# EAGLE design schematic (EAGLE 9.6.2)
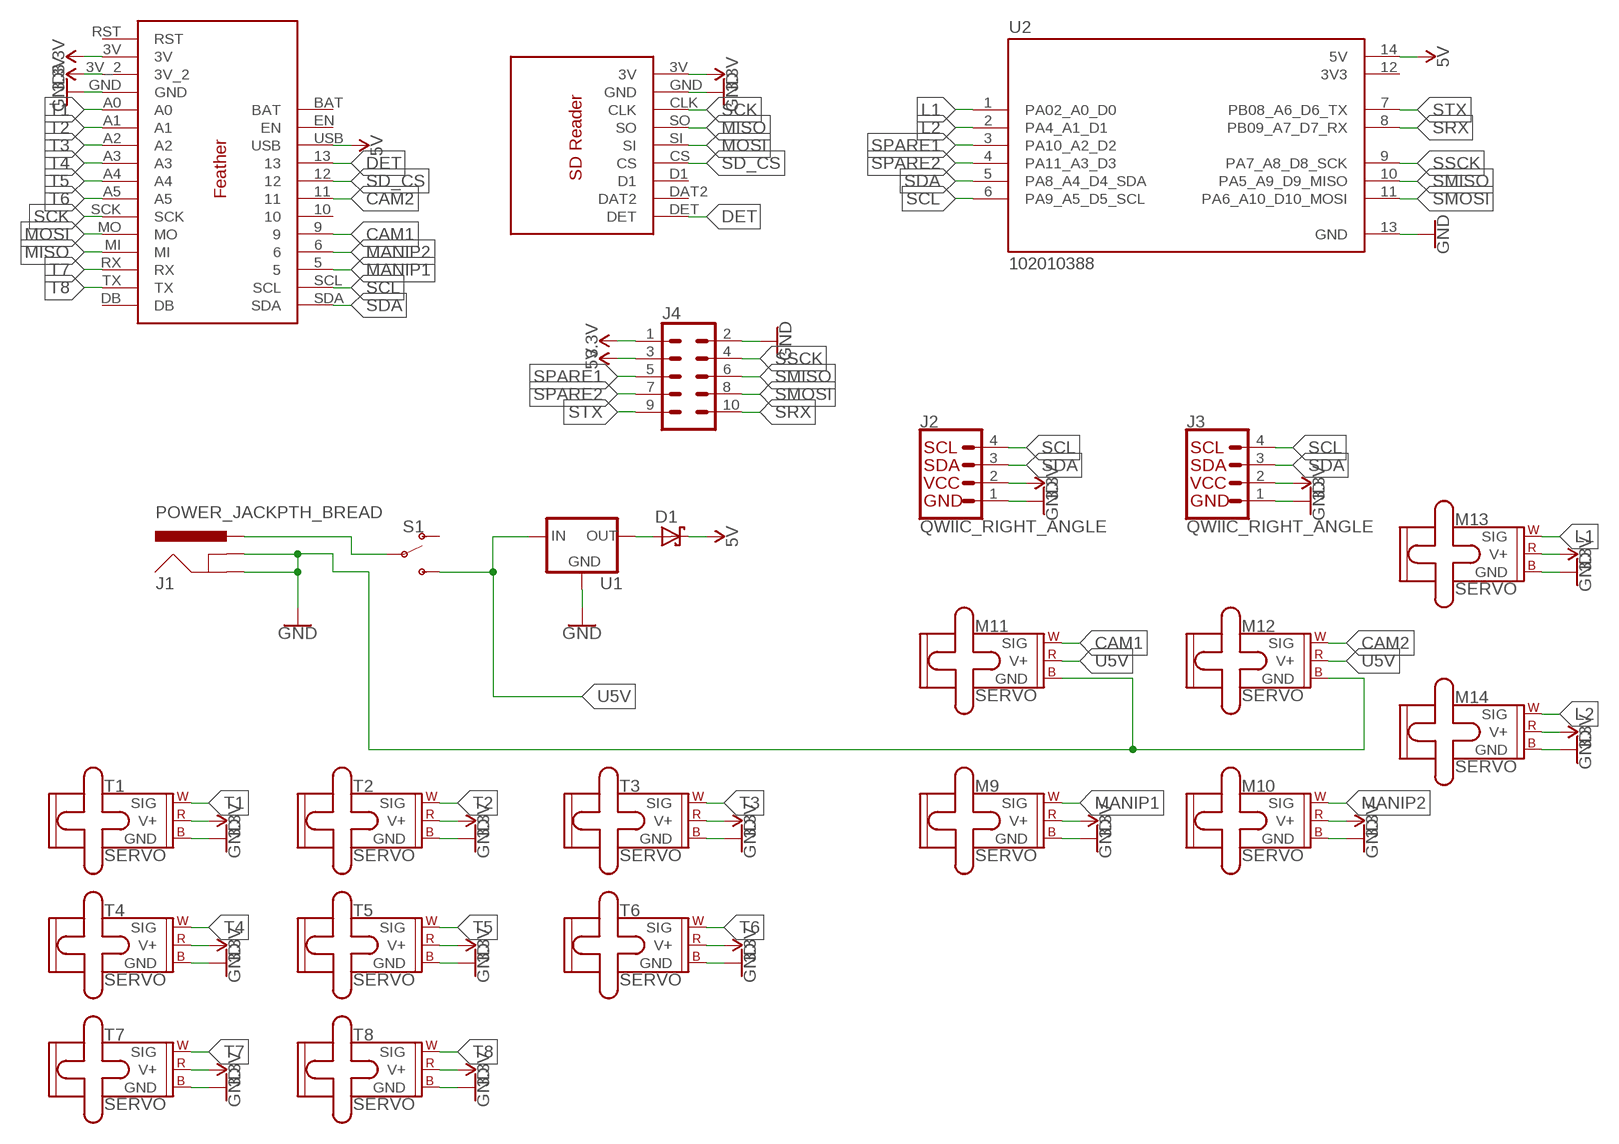
[diagram p0: schematic, sheet 1]

## Parts
D1  SCHOTTKY-DIODEDO41  [DO41-10]
J1  POWER_JACKPTH_BREAD  [POWER_JACK_PTH_BREAD]
J2  QWIIC_RIGHT_ANGLE  QWIIC_CONNECTORJS-1MM  [JST04_1MM_RA]
J3  QWIIC_RIGHT_ANGLE  QWIIC_CONNECTORJS-1MM  [JST04_1MM_RA]
J4  CONN_05X2PTH  [2X5]
M9  SERVO  [1X03]
M10  SERVO  [1X03]
M11  SERVO  [1X03]
M12  SERVO  [1X03]
M13  SERVO  [1X03]
M14  SERVO  [1X03]
S1  SWITCH-SPDT-PTH-11.6X4.0MM  [SWITCH_SPDT_PTH_11.6X4.0MM]
T1  SERVO  [1X03]
T2  SERVO  [1X03]
T3  SERVO  [1X03]
T4  SERVO  [1X03]
T5  SERVO  [1X03]
T6  SERVO  [1X03]
T7  SERVO  [1X03]
T8  SERVO  [1X03]
U1  V_REG_78XXSIDE  [78XXL]
U2  102010388  [MODULE_102010388]
U$1  FEATHER  [FEATHER]
U$3  SD  [SD]

## Nets
3.3V: J2.2 J3.2 J4.1 M9.2(V+) M10.2(V+) M13.2(V+) M14.2(V+) T1.2(V+) T2.2(V+) T3.2(V+) T4.2(V+) T5.2(V+) T6.2(V+) T7.2(V+) T8.2(V+) U$1.3V U$1.3V_2 U$3.3V
5V: D1.C J4.3 U2.14(5V) U$1.USB
CAM1: M11.1(SIG) U$1.9
CAM2: M12.1(SIG) U$1.11
DET: U$1.13 U$3.DET
GND: J1.GND J1.GNDBREAK J2.1 J3.1 J4.2 M9.3(GND) M10.3(GND) M11.3(GND) M12.3(GND) M13.3(GND) M14.3(GND) T1.3(GND) T2.3(GND) T3.3(GND) T4.3(GND) T5.3(GND) T6.3(GND) T7.3(GND) T8.3(GND) U1.GND U2.13(GND) U$1.GND U$3.GND
L1: M13.1(SIG) U2.1(PA02_A0_D0)
L2: M14.1(SIG) U2.2(PA4_A1_D1)
MANIP1: M9.1(SIG) U$1.5
MANIP2: M10.1(SIG) U$1.6
MISO: U$1.MI U$3.SO
MOSI: U$1.MO U$3.SI
N$2: J1.PWR S1.2(P)
N$25: D1.A U1.OUT
SCK: U$1.SCK U$3.CLK
SCL: J2.4 J3.4 U2.6(PA9_A5_D5_SCL) U$1.SCL
SD_CS: U$1.12 U$3.CS
SDA: J2.3 J3.3 U2.5(PA8_A4_D4_SDA) U$1.SDA
SMISO: J4.6 U2.10(PA5_A9_D9_MISO)
SMOSI: J4.8 U2.11(PA6_A10_D10_MOSI)
SPARE1: J4.5 U2.3(PA10_A2_D2)
SPARE2: J4.7 U2.4(PA11_A3_D3)
SRX: J4.10 U2.8(PB09_A7_D7_RX)
SSCK: J4.4 U2.9(PA7_A8_D8_SCK)
STX: J4.9 U2.7(PB08_A6_D6_TX)
T1: T1.1(SIG) U$1.A0
T2: T2.1(SIG) U$1.A1
T3: T3.1(SIG) U$1.A2
T4: T4.1(SIG) U$1.A3
T5: T5.1(SIG) U$1.A4
T6: T6.1(SIG) U$1.A5
T7: T7.1(SIG) U$1.RX
T8: T8.1(SIG) U$1.TX
U5V: M11.2(V+) M12.2(V+) S1.3(S) U1.IN
Unconnected: S1.1(O) U$1.10 U$1.BAT U$1.DB U$1.EN U$1.RST U$3.D1 U$3.DAT2

## Power pins joined to a net without a drawn wire
3V3: U2.12(3V3)

## Library data of the parts
D1 = adafruit:SCHOTTKY-DIODE: Schottky Diode
J1 = SparkFun-Connectors:POWER_JACK: Power Jack Connector This is the standard 5.5mm barrel jack for power. The PTH is the most common, proven, reliable, footprint. The Slot footprint only works if the mill layer is transmitted to the PCB fab house so be warned. Here are the connectors we sell at SparkFun: DC Barrel Power Jack/Connector <https://www.sparkfun.com/products/119> (PRT-00119) DC Barrel Power Jack/Connector (SMD) <https://www.sparkfun.com/products/12748> (PRT-12748) DC Barrel Jack Adapter - Breadboard Compatible <https://www.sparkfun.com/products/10811> (PRT-10811) It is used on this SparkFun product (and many, many others): SparkFun RedBoard - Programmed with Arduino <https://www.sparkfun.com/products/12757> (DEV-12757) Also, if you need a mating power supply or connector, please check these out: Wall Adapter Power Supply - 9VDC 650mA <https://www.sparkfun.com/products/298> (TOL-00298) DC Barrel Jack Adapter - Male <https://www.sparkfun.com/products/10287> (PRT-10287); PROD_ID: COMP-13253
J2 J3 = SparkFun-Connectors:QWIIC_CONNECTOR: SparkFun I2C Standard Qwiic Connector An SMD 1mm pitch JST connector makes it easy and quick (get it? Qwiic?) to connect I2C devices to each other. The Qwiic system <http://www.sparkfun.com/qwiic> enables fast and solderless connection between popular platforms and various sensors and actuators. We carry 200mm <https://www.sparkfun.com/products/14204>, 100mm <https://www.sparkfun.com/products/14205>, 50mm <https://www.sparkfun.com/products/14206>, and breadboard friendly <https://www.sparkfun.com/products/14207> Qwiic cables. We also offer 10 pcs strips <https://www.sparkfun.com/products/14323> the SMD connectors.; PROD_ID: CONN-13694
J4 = SparkFun-Connectors:CONN_05X2: Multi connection point. Often used as Generic Header-pin footprint for 0.1 inch spaced/style header connections For AVR SPI programming port, see special device with nice symbol: "AVR_SPI_PROG_5x2.dev" You can populate with any combo of single row headers, but if you'd like an exact match, check these: 2x5 AVR ICSP Male Header <https://www.sparkfun.com/products/778> (PRT-00778) 2x5 Pin Shrouded Header <https://www.sparkfun.com/products/8506> (PRT-08506) On any of the 0.1 inch spaced packages, you can populate with these: Break Away Headers - Straight <https://www.sparkfun.com/products/116> (PRT-00116) Break Away Male Headers - Right Angle <https://www.sparkfun.com/products/553> (PRT-00553) Female Headers <https://www.sparkfun.com/products/115> (PRT-00115) Break Away Headers - Machine Pin <https://www.sparkfun.com/products/117> (PRT-00117) Break Away Female Headers - Swiss Machine Pin <https://www.sparkfun.com/products/743> (PRT-00743) Special note: the shrouded connector mates well with our 5x2 ribbon cables: 2x5 Pin IDC Ribbon Cable <https://www.sparkfun.com/products/8535> (PRT-08535); PROD_ID: CONN-08499; SF_ID: PRT-0778
M9-M14 T1-T8 = SparkFun-Electromechanical:SERVO: Servo Motor 3-pin connector for a standard servo motor (voltage supply, ground, and control signal.) SparkFun Products Servo - Generic (Sub-Micro Size) <https://www.sparkfun.com/products/9065> (ROB-09065) Servo - Generic High Torque Continuous Rotation (Standard Size) <https://www.sparkfun.com/products/9347> (ROB-09347) Servo - Generic High Torque (Standard Size) <https://www.sparkfun.com/products/11965> (ROB-11965)
S1 = SparkFun-Switches:SWITCH-SPDT: Single Pole, Double Throw (SPDT) Switch Single-pole, double-throw (SPDT) switch. Variant Overview SMD-AYZ0202 Surface Mount DPDT Switch <https://www.sparkfun.com/products/597> (COM-00597) Used on e.g. LilyPad Arduino USB - ATmega32U4 Board <https://www.sparkfun.com/products/12049> PTH-11.6X4.0MM SPDT Mini Power Switch <https://www.sparkfun.com/products/102> (COM-00102) Used on e.g. SparkFun Simon Says - Through-Hole Soldering Kit <https://www.sparkfun.com/products/10547> (KIT-10547) PTH-11.6X4.0MM-KIT KIT version of SPDT Mini Power Switch - Simplifies soldering by removing tStop of switch pins - only one side can be soldered. PTH-11.6X4.0MM-LOCK LOCK version of SPDT Mini Power Switch - Offset pins hold switch in place for easier soldering. SMD-RIGHT-ANGLE Surface Mount Right Angle Switch <https://www.sparkfun.com/products/10860> (COM-10860) Used on e.g. SparkFun ESP8266 Thing <https://www.sparkfun.com/products/13231>; PROD_ID: SWCH-08261; SF_SKU: COM-00102
U1 = SparkFun-IC-Power:V_REG_78XX: Voltage Regulator Standard 78xx regulator. IGO (Input Ground Output). Spark Fun Electronics SKU : COM-00107
U2 = 102010388:102010388: Check availability <https://pricing.snapeda.com/parts/102010388/Seeed%20Technology%20Co.%2C%20Ltd/view-part?ref=eda>; AVAILABILITY: In Stock; DESCRIPTION: Seeeduino XIAO Development Board, Pre-Soldered [Seeed Studio] 102010388 Seeeduino XIAO Development Board, Pre-Soldered; MF: Seeed Technology Co., Ltd; MP: 102010388; PACKAGE: None; PRICE: None; PURCHASE-URL: https://pricing.snapeda.com/search/part/102010388/?ref=eda
U$1 = Robotics-Customs:FEATHER
U$3 = Robotics-Customs:SD

## Board
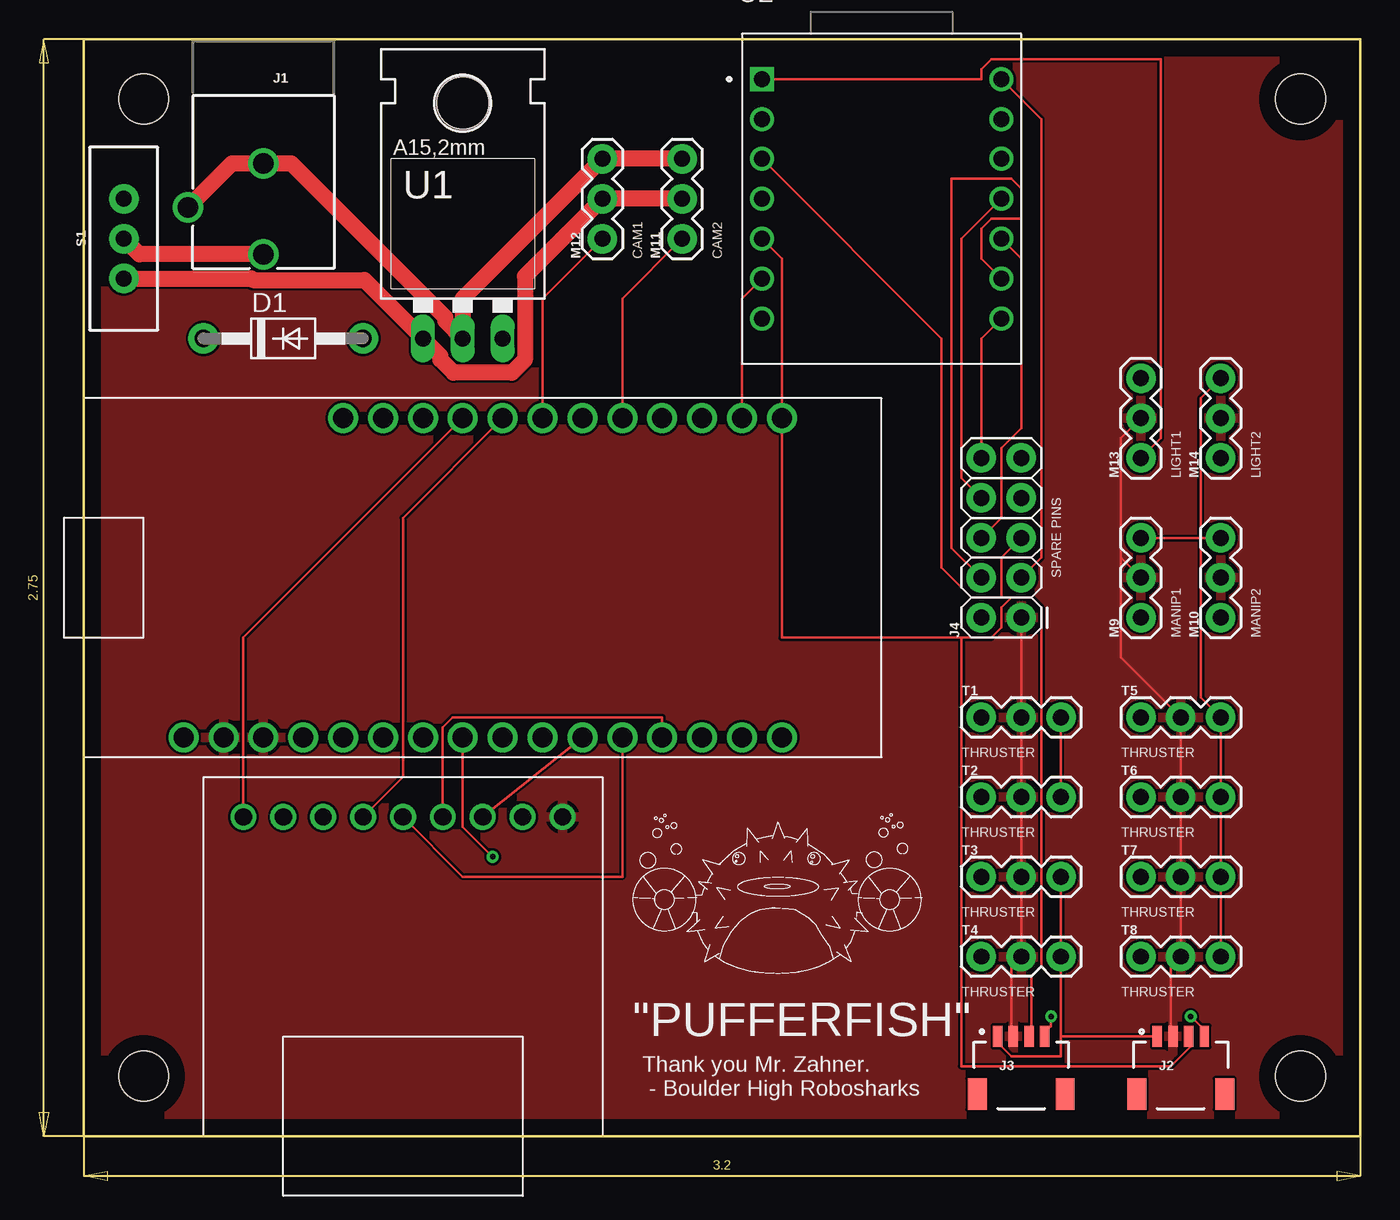
[diagram p1: board, top side]
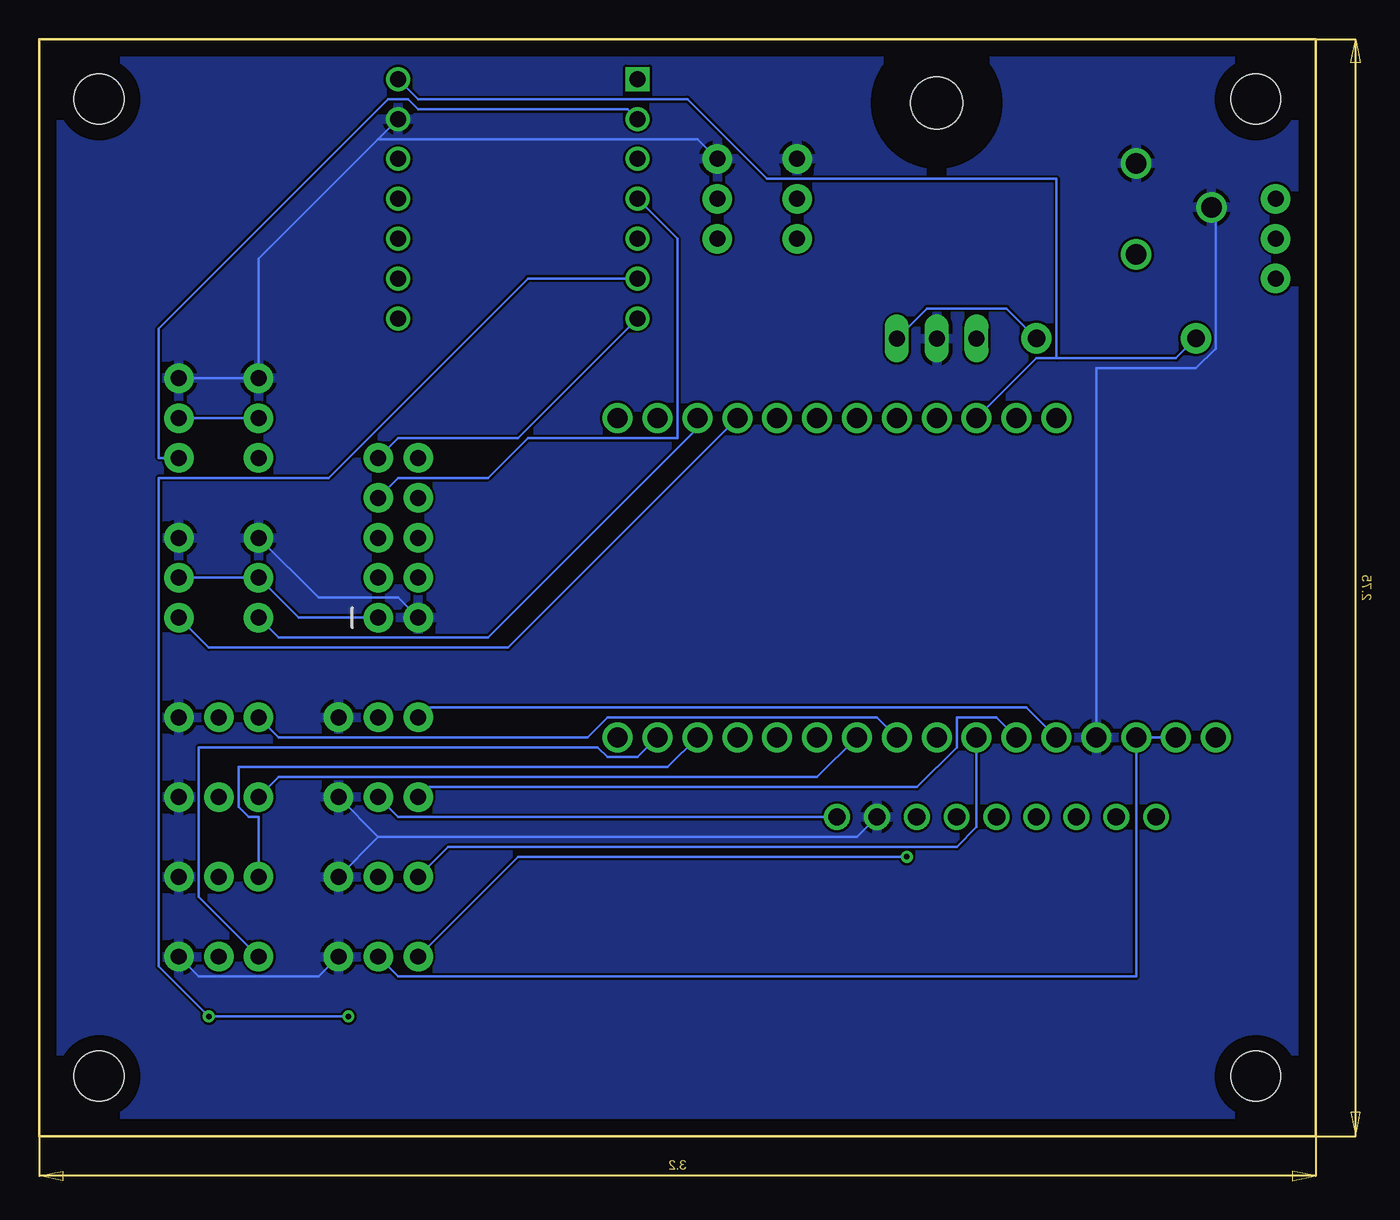
[diagram p2: board, bottom side, seen from below]

Size 81.28 x 69.85 mm. Coordinates in mm from the lower left corner, seen from the top.
Outline: 0,0 81.28,0 81.28,69.85 0,69.85 0,0
Copper layers (1*16): Top 0.035mm / dielectric 1.5mm / Bottom 0.035mm
Design rules "default": minimum track width 6mil, minimum drill 0.35mm, track to track 6mil, track to pad 6mil, pad to pad 6mil, via to via 6mil, smd to smd 6mil, copper to edge 40mil, drill to drill 6mil, minimum pad ring 10mil, minimum via ring 8mil, stop-mask expansion 4mil, vias tented up to drill 0mil, thermal gap 10mil
Holes 3.17 mm at 3.81,66.04 77.47,66.04 77.47,3.81 3.81,3.81

### Footprints (pad centres in the part's own frame; a part is rotated, then mirrored left to right if it is on the bottom)
DO41-10 = drill 1.118 pad 1.93: A 5.08,0; C -5.08,0
POWER_JACK_PTH_BREAD = drill 1.3: GND 0,7.9; GNDBREAK 4.8,10.7; PWR 0,13.7
JST04_1MM_RA = smd 0.6 x 1.35: 1 -1.5,0; 2 -0.5,0; 3 0.5,0; 4 1.5,0 | smd 1.2 x 2: NC1 2.8,-3.675; NC2 -2.8,-3.675
2X5 = drill 1.016 pad 1.88: 1 0,0; 2 0,2.54; 3 2.54,0; 4 2.54,2.54; 5 5.08,0; 6 5.08,2.54; 7 7.62,0; 8 7.62,2.54; 9 10.16,0; 10 10.16,2.54
1X03 = drill 1.016 pad 1.88: 1 0,0; 2 2.54,0; 3 5.08,0
SWITCH_SPDT_PTH_11.6X4.0MM = drill 1.016 pad 1.88: 1 0,2.54; 2 0,0; 3 0,-2.54
78XXL = drill 1.016 long: GND 0,-3.81; IN -2.54,-3.81; OUT 2.54,-3.81 | hole 3.302: 0,11.176
MODULE_102010388 = drill 1.02 square: 1 -7.62,7.62 | drill 1.02: 2 -7.62,5.08; 3 -7.62,2.54; 4 -7.62,0; 5 -7.62,-2.54; 6 -7.62,-5.08; 7 -7.62,-7.62; 8 7.62,-7.62; 9 7.62,-5.08; 10 7.62,-2.54; 11 7.62,0; 12 7.62,2.54; 13 7.62,5.08; 14 7.62,7.62
FEATHER = drill 1.27: 3V 1.27,41.91; 3V_2 1.27,39.37; 5 21.59,11.43; 6 21.59,13.97; 9 21.59,16.51; 10 21.59,19.05; 11 21.59,21.59; 12 21.59,24.13; 13 21.59,26.67; A0 1.27,34.29; A1 1.27,31.75; A2 1.27,29.21; A3 1.27,26.67; A4 1.27,24.13; A5 1.27,21.59; BAT 21.59,34.29; DB 1.27,6.35; EN 21.59,31.75; GND 1.27,36.83; MI 1.27,13.97; MO 1.27,16.51; RST 1.27,44.45; RX 1.27,11.43; SCK 1.27,19.05; SCL 21.59,8.89; SDA 21.59,6.35; TX 1.27,8.89; USB 21.59,29.21
SD = drill 1.1: 3V 20.32,2.54; CLK 20.32,7.62; CS 20.32,15.24; D1 20.32,17.78; DAT2 20.32,20.32; DET 20.32,22.86; GND 20.32,5.08; SI 20.32,12.7; SO 20.32,10.16

### Placement (x,y rotation side)
D1  12.7,50.8 0 top
J1  11.43,69.85 180 top
J2  69.85,6.35 0 top
J3  59.69,6.35 0 top
J4  59.69,33.02 90 top
M9  67.31,33.02 90 top
M10  72.39,33.02 90 top
M11  38.1,57.15 90 top
M12  33.02,57.15 90 top
M13  67.31,43.18 90 top
M14  72.39,43.18 90 top
S1  2.54,57.15 0 top
T1  57.15,26.67 0 top
T2  57.15,21.59 0 top
T3  57.15,16.51 0 top
T4  57.15,11.43 0 top
T5  67.31,26.67 0 top
T6  67.31,21.59 0 top
T7  67.31,16.51 0 top
T8  67.31,11.43 0 top
U1  24.13,54.61 0 top
U2  50.8,59.69 0 top
U$1  50.8,24.13 90 top
U$3  33.02,0 90 top

### Tracks (layer width: path | path; a pad name or v marks a point on that pad's centre or on a via)
3.3V
  Top 0.152: J3.2 59.05,6.35 59.05,10.79 T4.2 T3.2 T2.2 T1.2 J4.1 | J2.2 69.22,6.35 69.22,10.79 T8.2 T7.2 T6.2 T5.2 66.04,30.48 66.04,36.83 | M13.2 66.04,44.45 66.04,36.83 | M9.2 66.04,36.83
  Bottom 0.152: U$1.3V U$1.3V_2 11.43,10.16 58.42,10.16 T4.2 | M14.2 M13.2 | M10.2 M9.2 64.77,33.02 J4.1 | U$3.3V 58.42,20.32 T2.2
  pour Top: -5.08,73.66 -7.62,71.12 -7.62,-6.35 96.52,-6.35 97.79,-5.08 97.79,66.04 90.17,73.66
5V
  Top 0.152: U2.14 60.96,64.77 60.96,36.83 J4.3
  Bottom 0.152: U$1.USB 17.78,49.53 16.51,49.53 | 16.51,49.53 8.89,49.53 D1.C | 16.51,49.53 16.51,60.96 34.92,60.96 40.01,66.04 57.15,66.04 U2.14
CAM1
  Top 0.152: M11.1 34.29,53.34 U$1.9
CAM2
  Top 0.152: M12.1 29.21,53.34 U$1.11
DET
  Top 0.152: U$3.DET 10.16,31.75 U$1.13
GND
  Top 0.152: 62.23,6.35 T4.3 T3.3 | 62.23,6.35 62.23,5.08 59.05,5.08 58.42,5.71 58.42,6.35 J3.1 | 62.23,6.35 J2.1 68.58,6.35 | T2.3 T1.3 | T8.3 T7.3 T6.3 T5.3 71.12,27.94 71.12,38.1 | M9.3 71.12,38.1 | 71.12,38.1 M10.3 | M14.3 71.12,46.99 71.12,38.1
  Top 1.016: J1.GNDBREAK 9.43,61.95 J1.GND 13.21,61.95 23.01,52.15 23.01,51.92 U1.GND 24.13,53.34 M12.3 M11.3
  Bottom 0.152: U$3.GND 29.21,19.05 59.69,19.05 | T2.3 59.69,19.05 | 59.69,19.05 T3.3 | U$1.GND 13.97,48.9 7.62,48.9 6.35,50.16 6.35,59.05 J1.GNDBREAK | 59.69,63.5 67.31,55.88 M13.3 M14.3 | 59.69,63.5 U2.13 | J4.2 58.42,34.29 63.5,34.29 M9.3 | M11.3 39.37,63.5 59.69,63.5 | T4.3 63.5,10.16 71.12,10.16 T8.3
  pour Bottom: -7.62,73.66 -7.62,-3.81 -5.08,-6.35 -3.81,-7.62 105.41,-7.62 105.41,66.04 97.79,73.66
L1
  Top 0.152: U2.1 57.15,67.31 57.15,67.94 57.78,68.58 68.58,68.58 68.58,44.45 M13.1
L2
  Bottom 0.152: U2.2 43.81,65.41 57.15,65.41 57.78,66.04 59.05,66.04 73.66,51.44 73.66,43.18 M14.1
MANIP1
  Bottom 0.152: M9.1 66.04,31.75 52.7,31.75 39.37,45.09 U$1.5
MANIP2
  Bottom 0.152: M10.1 70.48,31.11 51.44,31.11 U$1.6
MISO
  Top 0.152: U$3.SO 22.86,26.04 23.5,26.67 36.83,26.67 U$1.MI
MOSI
  Top 0.152: U$3.SI 24.13,16.51 34.29,16.51 U$1.MO
N$2
  Top 1.016: J1.PWR 3.54,56.15 S1.2
N$25
  Bottom 0.152: U1.OUT 24.77,52.7 19.68,52.7 D1.A
SCK
  Top 0.152: U$3.CLK U$1.SCK
SCL  (via drill 0.35)
  Top 0.152: v61.59,7.62 61.59,6.99 60.96,6.35 J3.4 | v70.48,7.62 71.12,6.99 71.12,6.35 J2.4 | U2.6 41.91,53.34 U$1.SCL
  Bottom 0.152: v61.59,7.62 v70.48,7.62 73.66,10.79 73.66,41.91 62.87,41.91 50.16,54.61 U2.6
SD_CS
  Top 0.152: U$3.CS 20.32,22.86 20.32,39.37 U$1.12
SDA
  Top 0.152: 55.88,31.75 44.45,31.75 U$1.SDA 44.45,55.88 U2.5 | 55.88,31.75 57.78,31.75 58.42,32.38 58.42,33.66 59.05,34.29 60.33,34.29 60.96,33.66 60.96,10.79 60.33,10.16 60.33,6.35 J3.3 | 55.88,31.75 55.88,4.45 69.22,4.45 70.48,5.71 70.48,6.35 J2.3
SMISO
  Top 0.152: U2.10 59.69,55.88 59.69,45.09 58.42,43.81 58.42,39.37 J4.6
SMOSI
  Top 0.152: U2.11 55.88,57.15 55.88,41.91 J4.8
SPARE1
  Top 0.152: U2.3 54.61,50.8 54.61,36.2 56.52,34.29 58.42,34.29 58.42,36.83 J4.5
SPARE2
  Bottom 0.152: U2.4 40.64,57.15 40.64,44.45 50.16,44.45 52.7,41.91 58.42,41.91 J4.7
SRX
  Top 0.152: U2.8 57.15,50.8 J4.10
SSCK
  Top 0.152: U2.9 57.15,55.88 57.15,57.78 57.78,58.42 59.69,58.42 59.69,60.33 59.05,60.96 55.24,60.96 55.24,37.47 J4.4
STX
  Bottom 0.152: U2.7 50.8,44.45 58.42,44.45 J4.9
T1
  Bottom 0.152: T1.1 56.52,27.3 18.41,27.3 U$1.A0
T2
  Bottom 0.152: T2.1 56.52,22.23 25.4,22.23 22.86,24.77 22.86,26.67 20.32,26.67 U$1.A1
T3
  Bottom 0.152: T3.1 55.24,18.41 22.86,18.41 21.59,19.68 U$1.A2
T4  (via drill 0.35)
  Top 0.152: v26.04,17.78 24.13,19.68 U$1.A3
  Bottom 0.152: T4.1 50.8,17.78 v26.04,17.78
T5
  Bottom 0.152: T5.1 66.04,25.4 46.35,25.4 45.09,26.67 27.94,26.67 U$1.A4
T6
  Bottom 0.152: T6.1 66.04,22.86 31.75,22.86 U$1.A5
T7
  Bottom 0.152: T7.1 67.31,20.32 67.94,20.32 68.58,20.95 68.58,23.5 41.27,23.5 U$1.RX
T8
  Bottom 0.152: T8.1 71.12,15.24 71.12,24.77 45.72,24.77 45.09,24.13 43.18,24.13 U$1.TX
U5V
  Top 1.016: S1.3 10.66,54.61 10.75,54.52 17.88,54.52 U1.IN 22.71,49.68 22.71,49.45 23.54,48.62 27.26,48.62 28.09,49.45 28.09,54.76 M12.2 M11.2

### Text on the board
tNames: CAM1 | CAM2 | LIGHT1 | LIGHT2 | SPARE PINS | MANIP1 | MANIP2 | THRUSTER | THRUSTER | THRUSTER | THRUSTER | THRUSTER | THRUSTER | THRUSTER | THRUSTER | "PUFFERFISH" | Thank you Mr. Zahner. / - Boulder High Robosharks | /Users/ian/Desktop/Pufferfish/therealpuffa.bmp